# Altium schematic sheet Power_Supply.SchDoc
size A4; PageSetup: Record=PageOptions|CenterHorizontal=True|CenterVertical=True|PrintScale=0.92|XCorrection=1.00|YCorrection=1.00|PrintKind=0|BorderSize=5000000|LeftOffset=0|BottomOffset=0|Orientation=2|PaperLength=1000|PaperWidth=1000|Scale=100|PaperSource=7|PrintQuality=-4|MediaType=1|DitherType=10|PrintScaleMode=1|PaperKind=A4; CompanyName: Technische Hochschule Nürnberg Georg Simon Ohm; Organization: UltraZohm; Address1: Kesslerplatz 12; Address2: 90489 Nürnberg; Address3: GERMANY; DocumentNumber: 4; SheetNumber: 4; SheetTotal: 5; Website: www.ultrazohm.com
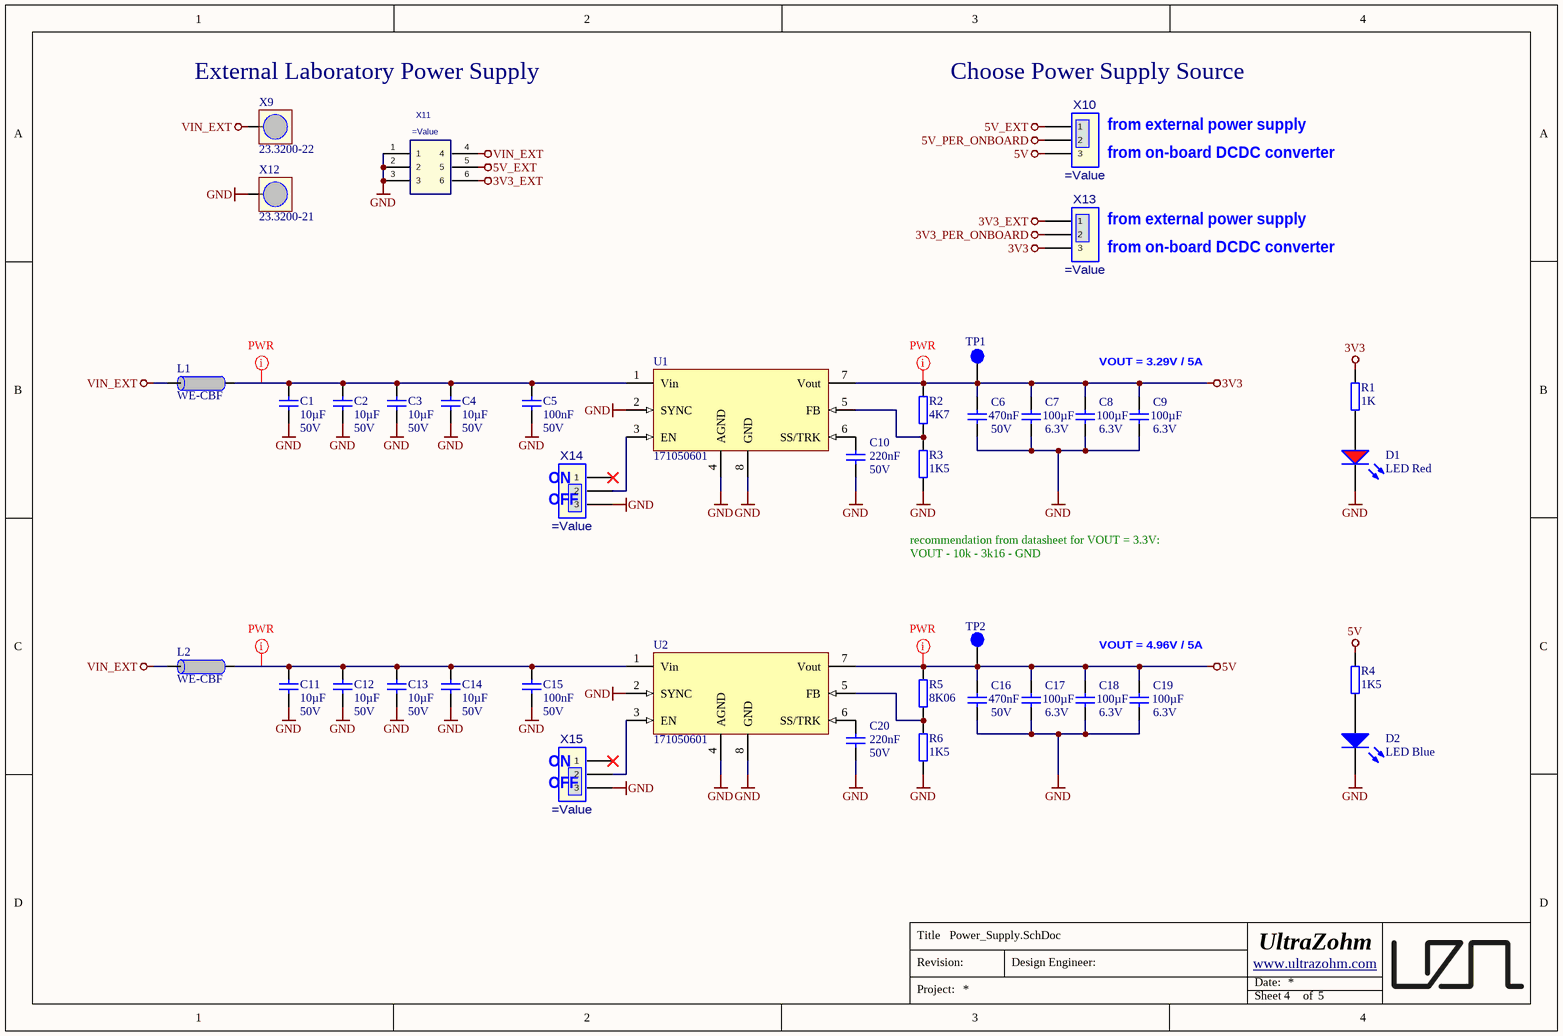
[diagram p0: Power_Supply.SchDoc]

## Parts
C1  10µF  Voltage: 50V  [CAPC3216X180N_V]
C2  10µF  Voltage: 50V  [CAPC3216X180N_V]
C3  10µF  Voltage: 50V  [CAPC3216X180N_V]
C4  10µF  Voltage: 50V  [CAPC3216X180N_V]
C5  100nF  Voltage: 50V  [CAPC1608X90N_V]
C6  470nF  Voltage: 50V  [CAPC1608X90N_V]
C7  100µF  Voltage: 6.3V  [CAPC3216X180N_V]
C8  100µF  Voltage: 6.3V  [CAPC3216X180N_V]
C9  100µF  Voltage: 6.3V  [CAPC3216X180N_V]
C10  220nF  Voltage: 50V  [CAPC1608X90N_V]
C11  10µF  Voltage: 50V  [CAPC3216X180N_V]
C12  10µF  Voltage: 50V  [CAPC3216X180N_V]
C13  10µF  Voltage: 50V  [CAPC3216X180N_V]
C14  10µF  Voltage: 50V  [CAPC3216X180N_V]
C15  100nF  Voltage: 50V  [CAPC1608X90N_V]
C16  470nF  Voltage: 50V  [CAPC1608X90N_V]
C17  100µF  Voltage: 6.3V  [CAPC3216X180N_V]
C18  100µF  Voltage: 6.3V  [CAPC3216X180N_V]
C19  100µF  Voltage: 6.3V  [CAPC3216X180N_V]
C20  220nF  Voltage: 50V  [CAPC1608X90N_V]
D1  LED Red  [WL-SMCW_0603]
D2  LED Blue  [WL-SMCW_0603]
L1  WE-CBF  [INDC2012X92N_V]
L2  WE-CBF  [INDC2012X92N_V]
R1  1K  [RESC1608X55N_V]
R2  4K7  [RESC1608X55N_V]
R3  1K5  [RESC1608X55N_V]
R4  1K5  [RESC1608X55N_V]
R5  8K06  [RESC1608X55N_V]
R6  1K5  [RESC1608X55N_V]
TP1  Testpoint 1mm  [TP_1mm]  (value not drawn)
TP2  Testpoint 1mm  [TP_1mm]  (value not drawn)
U1  171050601  [7TO-PMOD]
U2  171050601  [7TO-PMOD]
X9  23.3200-22  [Bannanenbuchse Rot Stäubli 23.3200-22]
X10  (no value)  [TSW-103-XX-XXX-S]
X11  (no value)  [IPL1-103-01-L-D-RA-K]
X12  23.3200-21  [Bannanenbuchse Schwarz Stäubli 23.3200-21]
X13  (no value)  [TSW-103-XX-XXX-S]
X14  (no value)  [TSW-103-XX-XXX-S]
X15  (no value)  [TSW-103-XX-XXX-S]

## Nets
3V3: C6.1 C7.1 C8.1 C9.1 R1.2 R2.2 TP1.1 U1.7(Vout) X13.3
3V3_EXT: X11.6 X13.1
3V3_PER_ONBOARD: X13.2
5V: C16.1 C17.1 C18.1 C19.1 R4.2 R5.2 TP2.1 U2.7(Vout) X10.3
5V_EXT: X10.1 X11.5
5V_PER_ONBOARD: X10.2
GND: C1.2 C2.2 C3.2 C4.2 C5.1 C6.2 C7.2 C8.2 C9.2 C10.2 C11.2 C12.2 C13.2 C14.2 C15.1 C16.2 C17.2 C18.2 C19.2 C20.2 D1.1(K) D2.1(K) R3.1 R6.2 U1.2(SYNC) U1.4(AGND) U1.8(GND) U2.2(SYNC) U2.4(AGND) U2.8(GND) X11.1 X11.2 X11.3 X12.1 X14.3 X15.3
VIN_EXT: L1.2 L2.2 X9.1 X11.4
NetC1_1: C1.1 C2.1 C3.1 C4.1 C5.2 L1.1 U1.1(Vin)
NetC10_1: C10.1 U1.6(SS/TRK)
NetC11_1: C11.1 C12.1 C13.1 C14.1 C15.2 L2.1 U2.1(Vin)
NetC20_1: C20.1 U2.6(SS/TRK)
NetD1_2: D1.2(A) R1.1
NetD2_2: D2.2(A) R4.1
NetR2_1: R2.1 R3.2 U1.5(FB)
NetR5_1: R5.1 R6.1 U2.5(FB)
NetU1_3: U1.3(EN) X14.2
NetU2_3: U2.3(EN) X15.2

Not connected (* = marked no-connect by the designer): X14 1*; X15 1*

## Layout directives
net class PWR: 3V3, 5V, NetC1_1, NetC11_1

## Notes on the sheet
- (near X9) External Laboratory Power Supply
- (near X10) Choose Power Supply Source
- (near X10) from external power supply
- (near X10) from on-board DCDC converter
- (near X13) from external power supply
- (near X13) from on-board DCDC converter
- VOUT = 3.29V / 5A
- ON
- (near X14) OFF
- recommendation from datasheet for VOUT = 3.3V:
  VOUT - 10k - 3k16 - GND
- VOUT = 4.96V / 5A
- (near X15) OFF
- Title
- Revision:
- Design Engineer:
- Date:
- Project:
- Sheet
- of

## Library data of the parts
C1-C4 C11-C14 = 24685: KON 10µF 50V X5R 10%  SMD BF 3216 (1206); Value: 10u; AN: 24685; Mixed: SMT; Temperature-Range: -55/+85; Preferred: Yes; Technology: X5R; Case: 3216 (1206); Tolerance: 10%
C5 C15 = 21382: KON 100nF 50V X7R ±10% SMD BF 1608 (0603); Value: 100n; AN: 21382; Mixed: SMT; Preferred: Yes; Temperature-Range: -55/+125; Tolerance: ±10%; Technology: X7R; Case: 1608 (0603)
C6 C16 = 25476: KON 470nF 50V X7R SMD  BF 1608 (0603); Value: 470n; AN: 25476; Mixed: SMT; Preferred: Yes; Temperature-Range: -55/+125; Technology: X7R; Case: 1608 (0603)
C7-C9 C17-C19 = 23116: KON 100µF 6,3V X5R 20% SMD BF 3216 (1206); AN: 23116; Mixed: SMT; Value: 100u; Preferred: Yes; Temperature-Range: -55/+85; Technology: X5R; Case: 3216 (1206); Tolerance: 20%
C10 C20 = 29694: KON 220nF 50V X7R ±10% SMD BF 1608 (0603); Value: 220n; AN: 29694; Mixed: SMT; Temperature-Range: -55/+125; Tolerance: ±10%; Technology: X7R; Case: 1608 (0603)
D1 = KT-0603R: LED RED 520~625NM 90~100MCD@20MA TOP VIEW 0603 ROHS; Manufacturer: Hubei KENTO Elec; Type: Standard; Created from: T. Wendt; Forward Current I_f: 20 mA; Forward Voltage U_f: 2.1 V; Wavelength: 620 nm; Light Intensity: 110 mcd; Nominal Power: 42 mW; Manufacturer Part Number: KT-0603R; PartID: 8; Created On: 03.03.2021 10:06:23; ComponentLink1Description: Datasheet; ComponentLink1URL: https://datasheet.lcsc.com/szlcsc/Hubei-KENTO-Elec-KT-0603R_C2286.pdf; Component Type: LED Diode; Device Package: 0603; Last Updated: 04.03.2021 09:02:49; Mounting Type: SMD; Operating Temperature: -40 - 85 °C; Supplier 1: LCSC; Supplier Part Number 1: C2286; Live Cycle Status: 1; Stock number: not stored; Color: red; LCSC Part Number: C2286
D2 = 19-217/BHC-ZL1M2RY/3T: LED BLUE 465~475NM 11.5~28.5MCD@5MA TOP VIEW 0603 ROHS; Manufacturer: Everlight Elec; Type: Standard; Created from: T. Wendt; Forward Current I_f: 20 mA; Forward Voltage U_f: 2.8 V; Wavelength: 470 nm; Nominal Power: 68 mW; Manufacturer Part Number: 19-217/BHC-ZL1M2RY/3T; PartID: 6; Created On: 03.03.2021 09:59:51; ComponentLink1Description: Datasheet; ComponentLink1URL: https://datasheet.lcsc.com/szlcsc/Everlight-Elec-19-217-BHC-ZL1M2RY-3T_C72041.pdf; Component Type: LED Diode; Device Package: 0603; Last Updated: 04.03.2021 09:02:49; Mounting Type: SMD; Operating Temperature: -40 - 85 °C; Supplier 1: LCSC; Supplier Part Number 1: C72041; Live Cycle Status: 1; Stock number: not stored; Color: blue; Light Intensity: 28.5 mcd; LCSC Part Number: C72041
L1 L2 = 24513: Ferritdurchführung SMD 0805; AN: 24513; Voltage: 2000mA; Mixed: SMT; Trenz-Stock: Yes; H-ART: 742792040; Extra: 0,15 Ohm DC, 600 Ohm bei 100MHz, 700 Ohm bei 150Mhz, 2000mA; Case: 2012 (0805); Technology: 0.15Ohm; HelpURL: B:\AD\adlib\datasheet\742792040
R1 = 21375: WID SMD 1K 1% 0,1W; AN: 21375; Mixed: SMT; Preferred: Yes; Extra: BF 1608 (0603); Value: 1K; Tolerance: 1%; Case: 1608 (0603); Technology: TK100
R2 = 21378: WID SMD 4K7 1% 0,1W BF 1608 (0603); Value: 4.7K; AN: 21378; Mixed: SMT; Preferred: Yes; Tolerance: 1%; Case: 1608 (0603); Technology: TK100
R3 R4 = 21514: WID SMD 1K5 1% 0,1W; Value: 1.5K; AN: 21514; Mixed: SMT; Extra: BF 1608 (0603); Tolerance: 1%; Case: 1608 (0603); Technology: TK100
R5 = 21378: WID SMD 8K06 1% 0,1W BF 1608 (0603); Value: 8.06K; Mixed: SMT; Preferred: Yes; Tolerance: 1%; Case: 1608 (0603); Technology: TK100
R6 = 21514: WID SMD 1K5 1% 0,1W; AN: 21514; Mixed: SMT; Value: 1.5K; Extra: BF 1608 (0603); Tolerance: 1%; Case: 1608 (0603); Technology: TK100
TP1 TP2 = 25063: AN: 25063; Mixed: SMT
U1 U2 = 26051: AN: 26051; Mixed: SMT; Extra: 6-36V 5A MagI³C Power Module; Voltage: Adj.; Temperature-Range: -40/+125 (Tj); HelpURL: B:\AD\adlib\datasheet\171050601; Case: TO263-7EP; H-ART: 171050601; Storage-Temperature: -65/+150 (Abs)
X9 = Banannenstecker-Buchse Stäubli Rot: MULTI-CONTACT   23.3200-22   BANANA SOCKET, 24A, 4MM, THT, R/A, RED; Voltage Rating: 1kV; Gender: Female; Part Number: 23.3200-22; Manufacturer: Stäubli; PnP Value: 23.3200-22; Value: 23.3200-22; Supplier 1: Farnell; Manufacturer Part Number: 23.3200-22; RoHS: Yes; Category: Uncategorized; Stock 1: 1111; Pricing 1: 1=10,51000, 5=8,01000, 10=7,81000, 25=6,92000, 50=6,48000, 75=6,35000 (EUR); Color: Red; Contact Material: Brass,Gold; Contact Plating: Gold; Insulation Material: PVC; Min Operating Temperature: -40°C; Max Operating Temperature: 80°C; Current Rating: 24A; Connector Type: Socket; Termination: Through Hole; Voltage Rating (DC): 1kV; Voltage Rating (AC): 1kV; Length: 33mm; REACH SVHC: No SVHC; ComponentLink1URL: https://datasheet.ciiva.com/1123/308583-1123144.pdf?src-supplier=Newark; ComponentLink1Description: https://datasheet.ciiva.com/1123/308583-1123144.pdf?src-supplier=Newark; ComponentLink2URL: https://datasheet.ciiva.com/16979/0900766b8025b994-16979960.pdf?src-supplier=Allied+Electronics; ComponentLink2Description: https://datasheet.ciiva.com/16979/0900766b8025b994-16979960.pdf?src-supplier=Allied+Electronics; ComponentLink3URL: https://datasheet.ciiva.com/29247/731096-da-01-ml-4-mm-einbaub-slb4i-90-rot-de-en-fr-29247831.pdf?src-supplier=Conrad; ComponentLink3Description: https://datasheet.ciiva.com/29247/731096-da-01-ml-4-mm-einbaub-slb4i-90-rot-de-en-fr-29247831.pdf?src-supplier=Conrad; PnP Package: BANANA SOCKET; Supplier Part Number 1: 4130261
X10 X13-X15 = TSW-103-XX-XXX-S: .025[0.64] SQ. POST TERMINAL STRIP ASSEMBLY.; Manufacturer: SAMTEC; MPN: TSW-103-07-F-S; Value: TSW-103-07-F-S; Created: 2020_11_26_AGeiger
X11 = IPL1-103-XX-X-D-X: 2.54mm Double Row Terminal Assembly; MF: SAMTEC; Created: 2018_05_02_AGeiger; Value: =MPN; MPN: IPL1-103-01-L-D-RA-K
X12 = Banannenstecker-Buchse Stäubli Schwarz: MULTI-CONTACT   23.3200-21   BANANA SOCKET, 24A, 4MM, THT, R/A, Black; Voltage Rating: 1kV; Gender: Female; Part Number: 23.3200-21; Manufacturer: Stäubli; PnP Value: 23.3200-21; Value: 23.3200-21; Manufacturer Part Number: 23.3200-21; RoHS: Yes; Category: Uncategorized; Color: Black; Contact Material: Brass,Gold; Contact Plating: Gold; Insulation Material: PVC; Min Operating Temperature: -40°C; Max Operating Temperature: 80°C; Current Rating: 24A; Connector Type: Socket; Termination: Through Hole; Voltage Rating (DC): 1kV; Voltage Rating (AC): 1kV; Length: 33mm; REACH SVHC: No SVHC; ComponentLink1URL: https://datasheet.ciiva.com/1123/308583-1123144.pdf?src-supplier=Newark; ComponentLink1Description: https://datasheet.ciiva.com/1123/308583-1123144.pdf?src-supplier=Newark; ComponentLink2URL: https://datasheet.ciiva.com/16979/0900766b8025b994-16979960.pdf?src-supplier=Allied+Electronics; ComponentLink2Description: https://datasheet.ciiva.com/16979/0900766b8025b994-16979960.pdf?src-supplier=Allied+Electronics; ComponentLink3URL: https://datasheet.ciiva.com/29247/731096-da-01-ml-4-mm-einbaub-slb4i-90-rot-de-en-fr-29247831.pdf?src-supplier=Conrad; ComponentLink3Description: https://datasheet.ciiva.com/29247/731096-da-01-ml-4-mm-einbaub-slb4i-90-rot-de-en-fr-29247831.pdf?src-supplier=Conrad; PnP Package: BANANA SOCKET; Supplier 1: Farnell; Supplier Part Number 1: 1085521